# Altium project Jukebox Project.PrjPCB
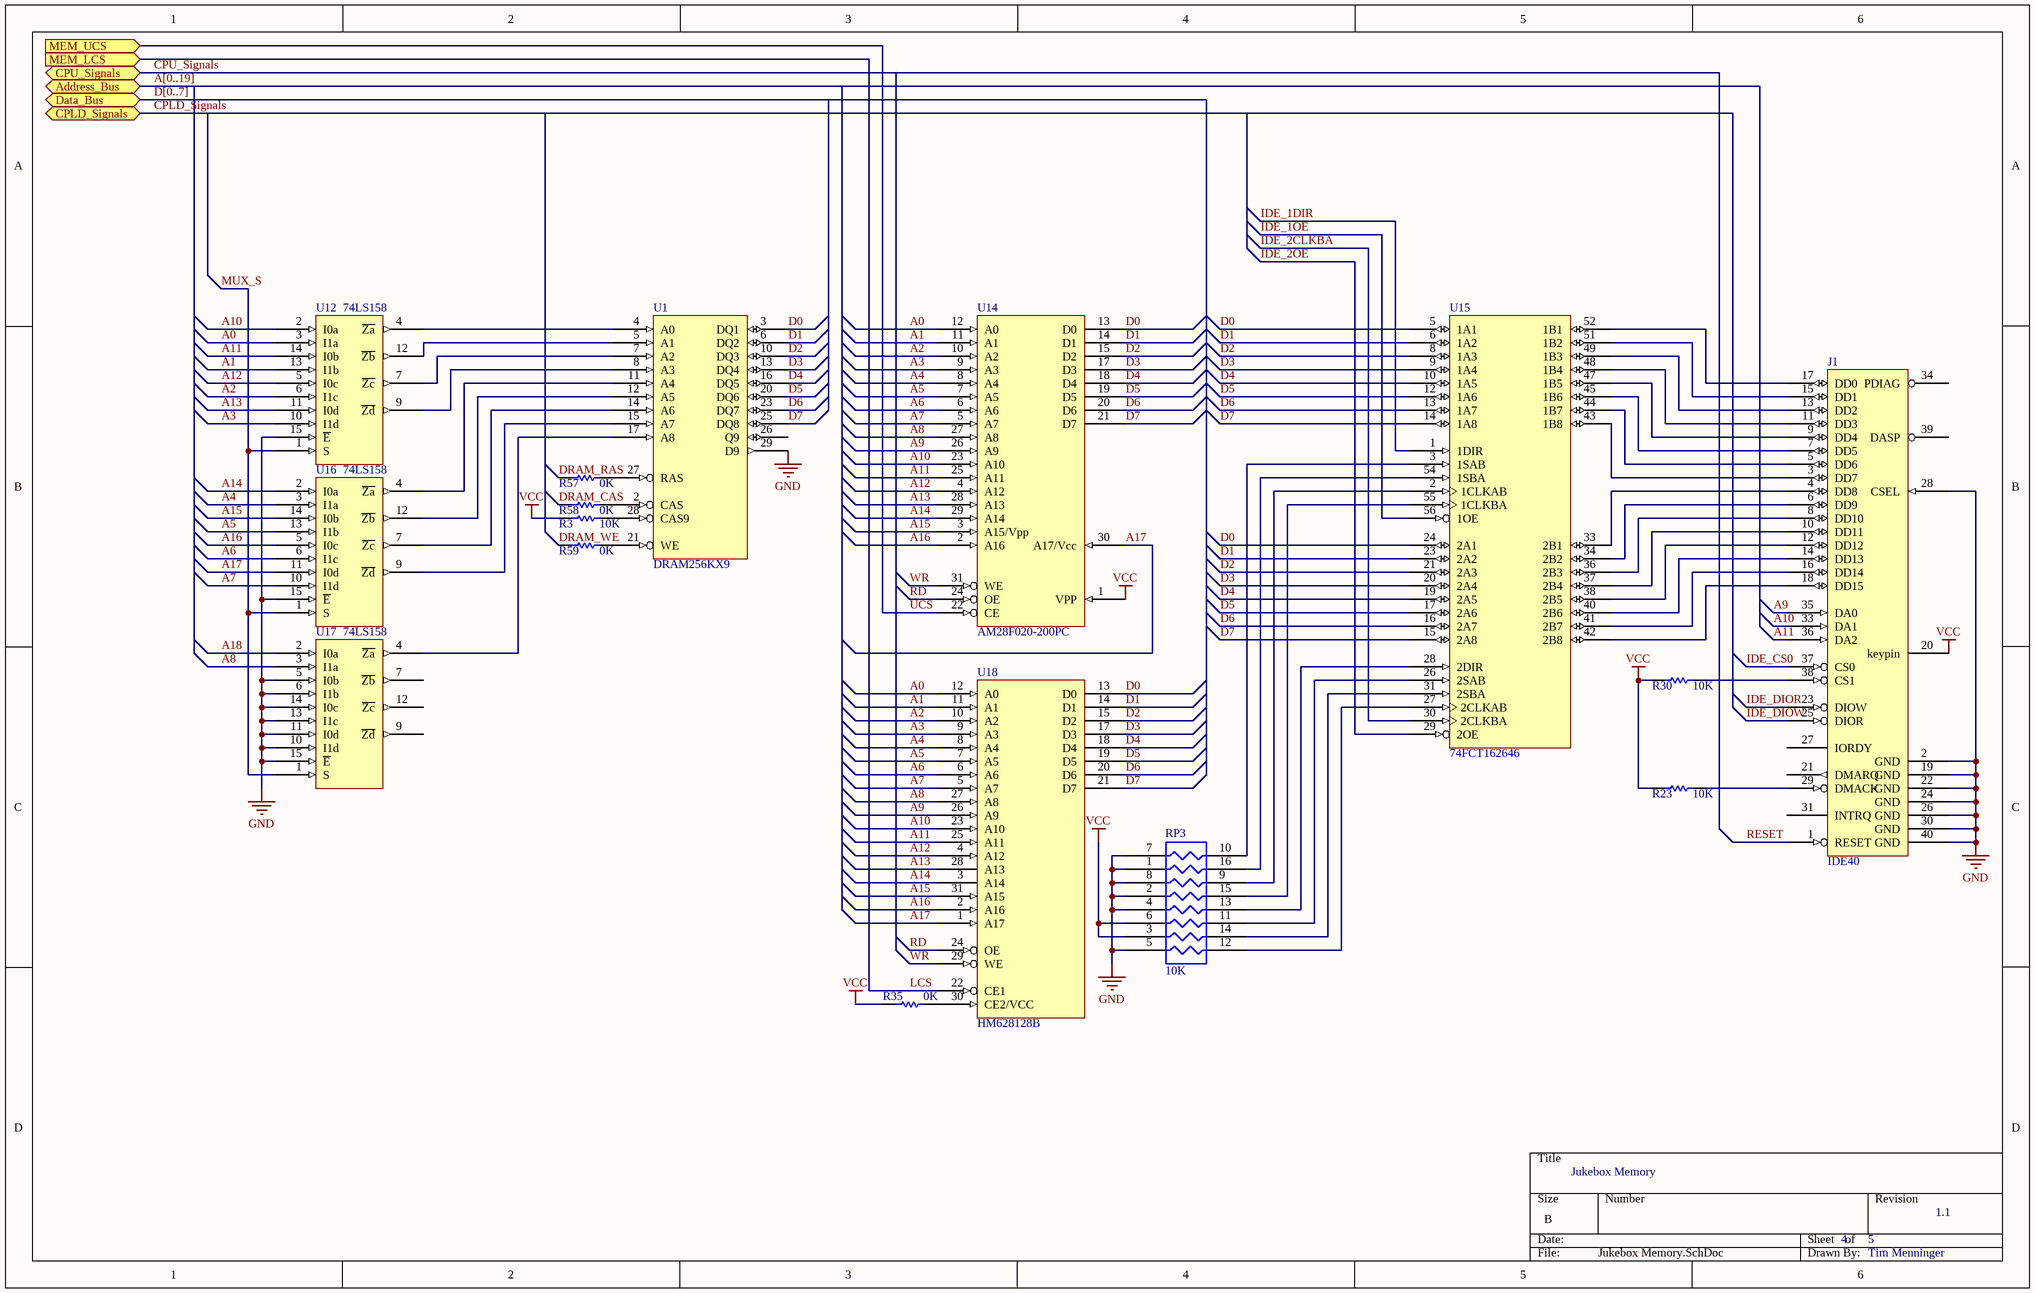
[diagram p0: Jukebox Memory.SchDoc]
4 sheets, 139 parts. Net scope: global (net labels, ports and power ports of the same name join across sheets).
Board file: Jukebox PCB.PCBDOC
Sheets:
  Jukebox Memory.SchDoc
  Jukebox Peripherals.SchDoc
  Jukebox Power.SchDoc
  Jukebox Processing.SchDoc

## Sheet Jukebox Memory.SchDoc: Jukebox Memory
size B; DrawnBy: Tim Menninger; Revision: 1.1; SheetNumber: 4; SheetTotal: 5

### Parts
J1  IDE40  [SIP2X20]
R3  value 10K  [6-0805_L]  (hidden comment: Res1)
R23  value 10K  [6-0805_L]  (hidden comment: Res1)
R30  value 10K  [6-0805_L]  (hidden comment: Res1)
R35  value 0K  [6-0805_L]  (hidden comment: Res1)
R57  value 0K  [6-0805_L]  (hidden comment: Res1)
R58  value 0K  [6-0805_L]  (hidden comment: Res1)
R59  value 0K  [6-0805_L]  (hidden comment: Res1)
RP3  10K  [SSOP16]
U1  DRAM256KX9  [SIMM30]
U12  74LS158  [DIPS16]
U14  AM28F020-200PC  [DIPS32]
U15  74FCT162646  [SSOP56]
U16  74LS158  [DIPS16]
U17  74LS158  [DIPS16]
U18  HM628128B  [DIPS32.300]

### Ports
Address_Bus, CPLD_Signals, CPU_Signals, Data_Bus, MEM_LCS (in), MEM_UCS (in)

### Nets
GND: J1.2(GND) J1.19(GND) J1.22(GND) J1.24(GND) J1.26(GND) J1.28(CSEL) J1.30(GND) J1.40(GND) RP3.1 RP3.2 RP3.4 RP3.5 RP3.7 RP3.8 U1.9(GND) U1.22(GND) U1.29(D9) U12.8(GND) U12.15(~{E}) U14.16(GND) U15.4(GND) U15.11(GND) U15.18(GND) U15.25(GND) U15.32(GND) U15.39(GND) U15.46(GND) U15.53(GND) U16.8(GND) U16.15(~{E}) U17.5(I0b) U17.6(I1b) U17.8(GND) U17.10(I1d) U17.11(I0d) U17.13(I1c) U17.14(I0c) U17.15(~{E}) U18.16(GND)
VCC: J1.20(keypin) R3.2 R23.2 R30.2 R35.2 RP3.3 RP3.6 U1.1(VCC) U1.30(VCC) U12.16(VCC) U14.1(VPP) U14.32(VCC) U15.7(VCC) U15.22(VCC) U15.35(VCC) U15.50(VCC) U16.16(VCC) U17.16(VCC) U18.32(VCC)
A0: U12.3(I1a) U14.12(A0) U18.12(A0)
A1: U12.13(I1b) U14.11(A1) U18.11(A1)
A2: U12.6(I1c) U14.10(A2) U18.10(A2)
A3: U12.10(I1d) U14.9(A3) U18.9(A3)
A4: U14.8(A4) U16.3(I1a) U18.8(A4)
A5: U14.7(A5) U16.13(I1b) U18.7(A5)
A6: U14.6(A6) U16.6(I1c) U18.6(A6)
A7: U14.5(A7) U16.10(I1d) U18.5(A7)
A8: U14.27(A8) U17.3(I1a) U18.27(A8)
A9: J1.35(DA0) U14.26(A9) U18.26(A9)
A10: J1.33(DA1) U12.2(I0a) U14.23(A10) U18.23(A10)
A11: J1.36(DA2) U12.14(I0b) U14.25(A11) U18.25(A11)
A12: U12.5(I0c) U14.4(A12) U18.4(A12)
A13: U12.11(I0d) U14.28(A13) U18.28(A13)
A14: U14.29(A14) U16.2(I0a) U18.3(A14)
A15: U14.3(A15/Vpp) U16.14(I0b) U18.31(A15)
A16: U14.2(A16) U16.5(I0c) U18.2(A16)
A17: U14.30(A17/Vcc) U16.11(I0d) U18.1(A17)
A18: U17.2(I0a)
D0: U1.3(DQ1) U14.13(D0) U15.5(1A1) U15.24(2A1) U18.13(D0)
D1: U1.6(DQ2) U14.14(D1) U15.6(1A2) U15.23(2A2) U18.14(D1)
D2: U1.10(DQ3) U14.15(D2) U15.8(1A3) U15.21(2A3) U18.15(D2)
D3: U1.13(DQ4) U14.17(D3) U15.9(1A4) U15.20(2A4) U18.17(D3)
D4: U1.16(DQ5) U14.18(D4) U15.10(1A5) U15.19(2A5) U18.18(D4)
D5: U1.20(DQ6) U14.19(D5) U15.12(1A6) U15.17(2A6) U18.19(D5)
D6: U1.23(DQ7) U14.20(D6) U15.13(1A7) U15.16(2A7) U18.20(D6)
D7: U1.25(DQ8) U14.21(D7) U15.14(1A8) U15.15(2A8) U18.21(D7)
DRAM_CAS: R58.2
DRAM_RAS: R57.2
DRAM_WE: R59.2
IDE_1DIR: U15.1(1DIR)
IDE_1OE: U15.56(1OE)
IDE_2CLKBA: U15.30(2CLKBA)
IDE_2OE: U15.29(2OE)
IDE_CS0: J1.37(CS0)
IDE_DIOR: J1.23(DIOW)
IDE_DIOW: J1.25(DIOR)
LCS: U18.22(CE1) ; port MEM_LCS
MUX_S: U12.1(S) U16.1(S) U17.1(S)
RD: U14.24(OE) U18.24(OE)
RESET: J1.1(RESET)
UCS: U14.22(CE) ; port MEM_UCS
WR: U14.31(WE) U18.29(WE)
NetJ1_3: J1.3(DD7) U15.43(1B8)
NetJ1_4: J1.4(DD8) U15.33(2B1)
NetJ1_5: J1.5(DD6) U15.44(1B7)
NetJ1_6: J1.6(DD9) U15.34(2B2)
NetJ1_7: J1.7(DD5) U15.45(1B6)
NetJ1_8: J1.8(DD10) U15.36(2B3)
NetJ1_9: J1.9(DD4) U15.47(1B5)
NetJ1_10: J1.10(DD11) U15.37(2B4)
NetJ1_11: J1.11(DD3) U15.48(1B4)
NetJ1_12: J1.12(DD12) U15.38(2B5)
NetJ1_13: J1.13(DD2) U15.49(1B3)
NetJ1_14: J1.14(DD13) U15.40(2B6)
NetJ1_15: J1.15(DD1) U15.51(1B2)
NetJ1_16: J1.16(DD14) U15.41(2B7)
NetJ1_17: J1.17(DD0) U15.52(1B1)
NetJ1_18: J1.18(DD15) U15.42(2B8)
NetJ1_29: J1.29(DMACK) R23.1
NetJ1_38: J1.38(CS1) R30.1
NetR3_1: R3.1 U1.28(CAS9)
NetR35_1: R35.1 U18.30(CE2/VCC)
NetR57_1: R57.1 U1.27(RAS)
NetR58_1: R58.1 U1.2(CAS)
NetR59_1: R59.1 U1.21(WE)
NetRP3_9: RP3.9 U15.2(1CLKAB)
NetRP3_10: RP3.10 U15.3(1SAB)
NetRP3_11: RP3.11 U15.26(2SAB)
NetRP3_12: RP3.12 U15.27(2CLKAB)
NetRP3_13: RP3.13 U15.28(2DIR)
NetRP3_14: RP3.14 U15.31(2SBA)
NetRP3_15: RP3.15 U15.55(1CLKBA)
NetRP3_16: RP3.16 U15.54(1SBA)
NetU1_4: U1.4(A0) U12.4(~{Za})
NetU1_5: U1.5(A1) U12.12(~{Zb})
NetU1_7: U1.7(A2) U12.7(~{Zc})
NetU1_8: U1.8(A3) U12.9(~{Zd})
NetU1_11: U1.11(A4) U16.4(~{Za})
NetU1_12: U1.12(A5) U16.12(~{Zb})
NetU1_14: U1.14(A6) U16.7(~{Zc})
NetU1_15: U1.15(A7) U16.9(~{Zd})
NetU1_17: U1.17(A8) U17.4(~{Za})

Not connected (* = marked no-connect by the designer): J1 21(DMARQ) 27(IORDY) 31(INTRQ) 34(PDIAG) 39(DASP); U1 26(Q9); U17 7(~{Zb}) 9(~{Zd}) 12(~{Zc})

### Buses and harness runs
bus A[0..19] = port Address_Bus
bus CPLD_Signals = port CPLD_Signals
bus CPU_Signals = port CPU_Signals
bus D[0..7] = port Data_Bus

### Library data of the parts
J1 = IDE40: 40-Pin IDE Connector
R3 R23 R30 R35 R57-R59 = Res1: Resistor; Published: 8-Jun-2000; LatestRevisionDate: 17-Jul-2002; LatestRevisionNote: Re-released for DXP Platform.; PackageReference: AXIAL-0.3; Publisher: Altium Limited; PackageDescription: Axial Device, Thru-Hole; 2 Leads; 0.3 in Pin Spacing
RP3 = RPACK8: Resistor Pack - 8 Resistors
U1 = DRAM256KX9: 256K x 9 DRAM SIMM
U14 = UNIROM: Universal EPROM/EEROM Socket
U15 = 74FCT16646: 16-Bit Bus Transceiver/Register
U18 = UNIRAM: Universal RAM Socket

## Sheet Jukebox Peripherals.SchDoc: Jukebox Peripherals
size B; DrawnBy: Tim Menninger; Revision: 1.1; SheetNumber: 3; SheetTotal: 5
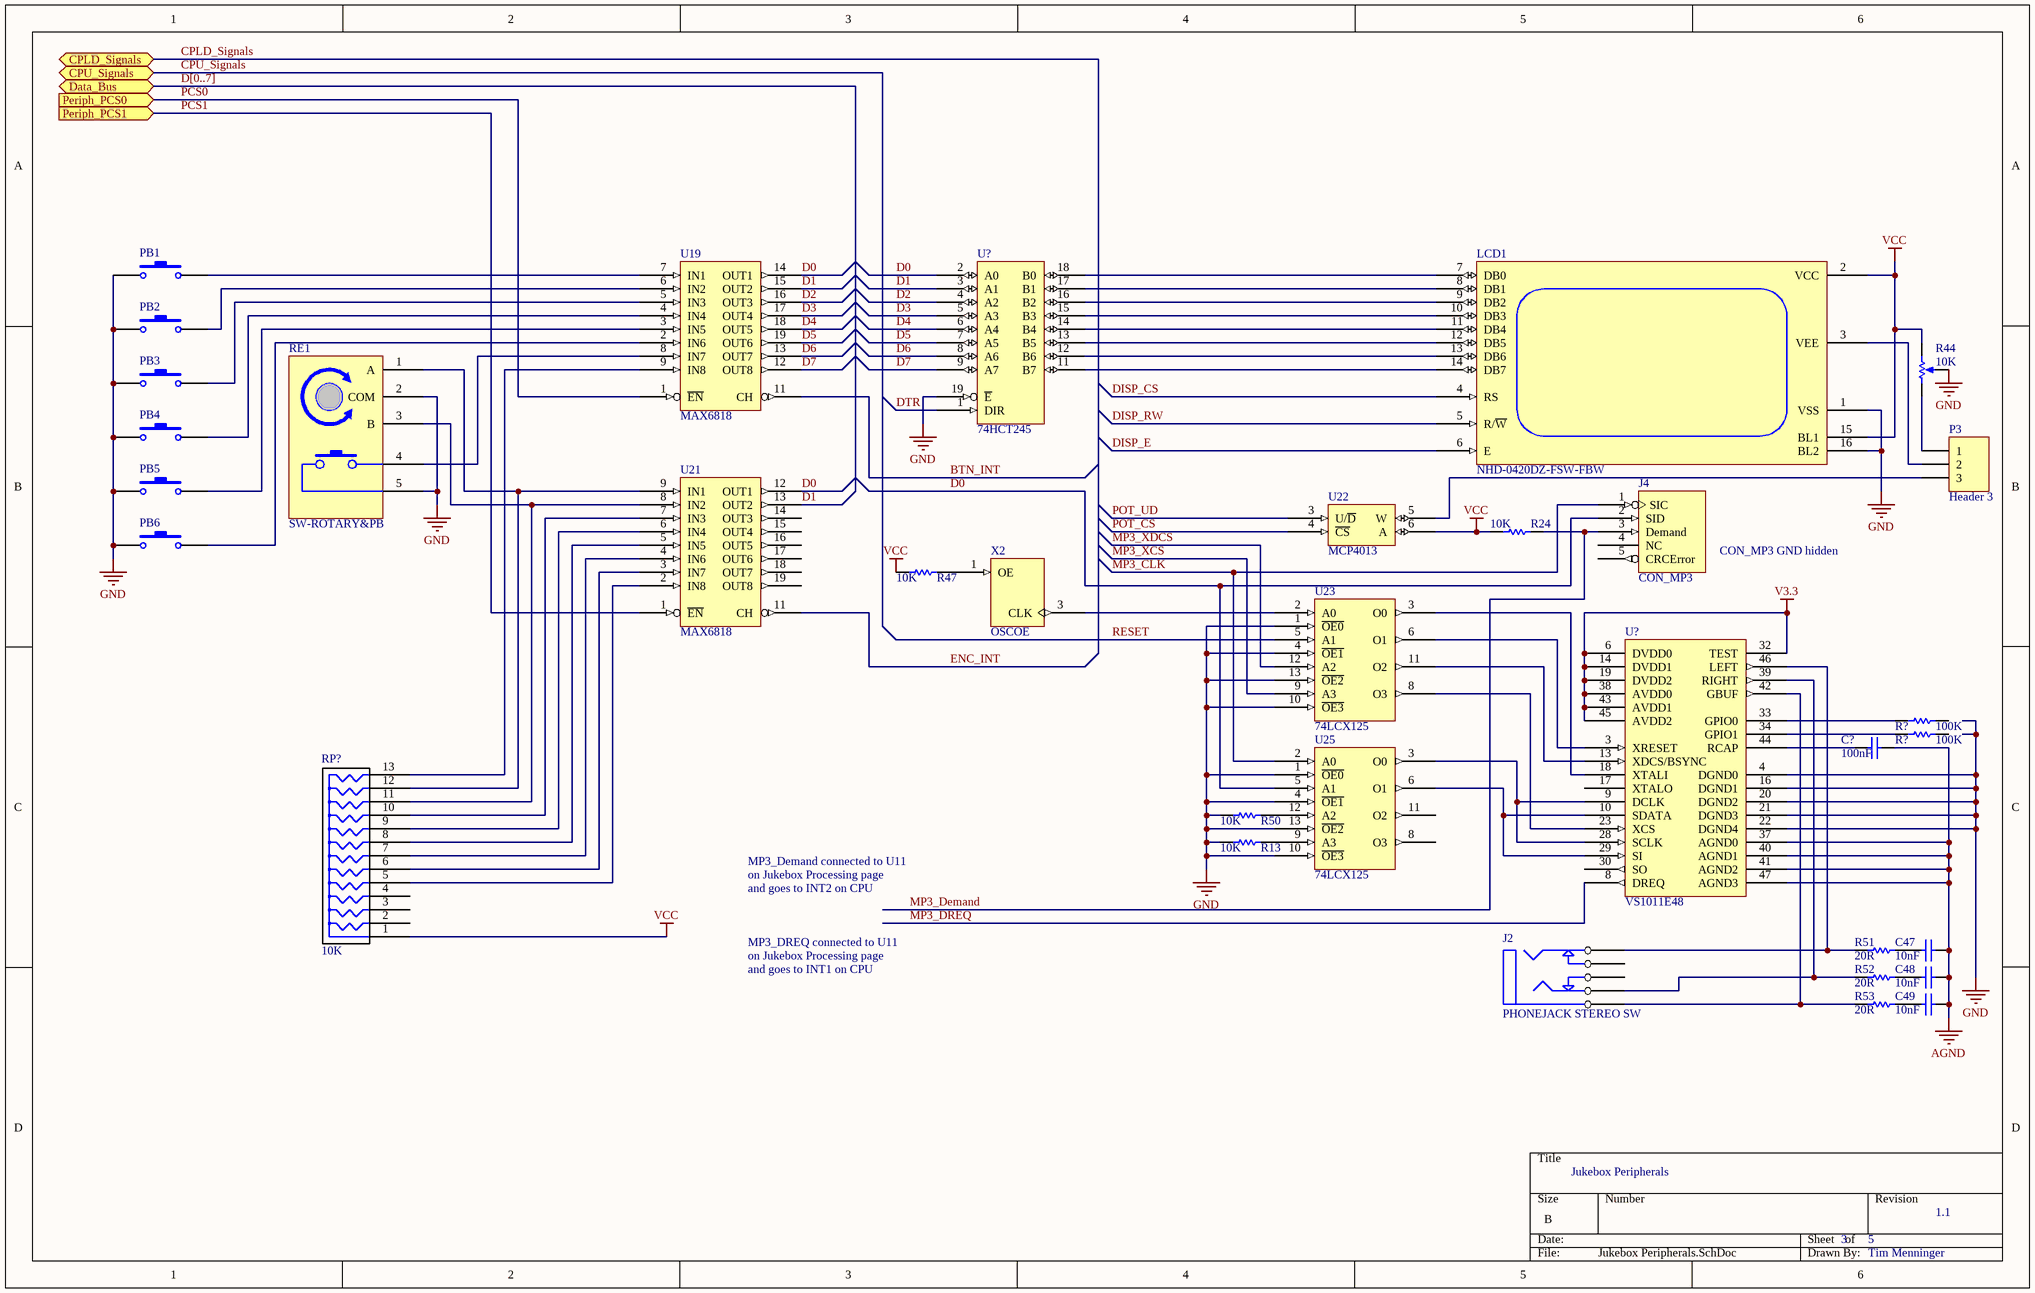
[diagram p1: Jukebox Peripherals.SchDoc]

### Parts
(Parts that share a designator on the sheet are numbered #1, #2 ... from top to bottom, then left to right.)
C47  value 10nF  [C0805]  (hidden comment: Cap)
C48  value 10nF  [C0805]  (hidden comment: Cap)
C49  value 10nF  [C0805]  (hidden comment: Cap)
C?  value 100nF  [C0805]  (hidden comment: Cap)
J2  PHONEJACK STEREO SW  [SJ1-352]
J4  CON_MP3  [MDIN6]
LCD1  NHD-0420DZ-FSW-FBW  [20x4Disp]
P3  Header 3  [HDR1X3]
PB1  SW-PB  [PB_EG4791]  (value not drawn)
PB2  SW-PB  [PB_EG4791]  (value not drawn)
PB3  SW-PB  [PB_EG4791]  (value not drawn)
PB4  SW-PB  [PB_EG4791]  (value not drawn)
PB5  SW-PB  [PB_EG4791]  (value not drawn)
PB6  SW-PB  [PB_EG4791]  (value not drawn)
R13  value 10K  [6-0805_L]  (hidden comment: Res1)
R24  value 10K  [6-0805_L]  (hidden comment: Res1)
R44  value 10K  [VR4]  (hidden comment: RPot)
R47  value 10K  [6-0805_L]  (hidden comment: Res1)
R50  value 10K  [6-0805_L]  (hidden comment: Res1)
R51  value 20R  [6-0805_L]  (hidden comment: Res1)
R52  value 20R  [6-0805_L]  (hidden comment: Res1)
R53  value 20R  [6-0805_L]  (hidden comment: Res1)
R?#1  value 100K  [6-0805_L]  (hidden comment: Res1)
R?#2  value 100K  [6-0805_L]  (hidden comment: Res1)
RE1  SW-ROTARY&PB  [ROTENCPB]
RP?#1  10K
U19  MAX6818  [SSOP20]
U21  MAX6818  [SSOP20]
U22  MCP4013  [SOT-23-6]
U23  74LCX125  [SOIC 14]
U25  74LCX125  [SOIC 14]
U?#1  74HCT245  [DIP20]
U?#2  VS1011E48  [LQFP48]
X2  OSCOE  [DIP14-4]

### Ports
CPLD_Signals, CPU_Signals, Data_Bus, Periph_PCS0 (in), Periph_PCS1 (in)

### Nets
AGND: C47.2 C48.2 C49.2 C?.2 U23.7(AGND) U25.7(AGND) U?#2.37(AGND0) U?#2.40(AGND1) U?#2.41(AGND2) U?#2.47(AGND3)
GND: LCD1.1(VSS) LCD1.16(BL2) PB1.1 PB2.1 PB3.1 PB4.1 PB5.1 PB6.1 R13.1 R44.3(TAP) R50.1 RE1.2(COM) RE1.5 U19.10(GND) U21.10(GND) U22.2(GND) U23.1(~{O}~{E}~{0}) U23.4(~{O}~{E}~{1}) U23.10(~{OE3}) U23.13(~{OE2}) U25.1(~{O}~{E}~{0}) U25.4(~{O}~{E}~{1}) U25.10(~{OE3}) U25.13(~{OE2}) U?#1.10(GND) U?#1.19(~{E}) U?#2.4(DGND0) U?#2.16(DGND1) U?#2.20(DGND2) U?#2.21(DGND3) U?#2.22(DGND4) X2.2(GND)
V3.3: U23.14(VCC) U25.14(VCC) U?#2.6(DVDD0) U?#2.14(DVDD1) U?#2.19(DVDD2) U?#2.32(TEST) U?#2.38(AVDD0) U?#2.43(AVDD1) U?#2.45(AVDD2)
VCC: LCD1.2(VCC) LCD1.15(BL1) R24.1 R44.2(BOT) R47.1 RP?#1.1 U19.20(VCC) U21.20(VCC) U22.1(VCC) U22.6(A) U?#1.20(VCC) X2.4(VCC)
BTN_INT: U19.11(CH)
D0: J4.2(SID) U19.14(OUT1) U21.12(OUT1) U25.5(A1) U?#1.2(A0)
D1: U19.15(OUT2) U21.13(OUT2) U?#1.3(A1)
D2: U19.16(OUT3) U?#1.4(A2)
D3: U19.17(OUT4) U?#1.5(A3)
D4: U19.18(OUT5) U?#1.6(A4)
D5: U19.19(OUT6) U?#1.7(A5)
D6: U19.13(OUT7) U?#1.8(A6)
D7: U19.12(OUT8) U?#1.9(A7)
DISP_CS: LCD1.4(RS)
DISP_E: LCD1.6(E)
DISP_RW: LCD1.5(R/~{W})
DTR: U?#1.1(DIR)
ENC_INT: U21.11(CH)
MP3_CLK: J4.1(SIC) U25.2(A0)
MP3_Demand: J4.3(Demand) R24.2
MP3_DREQ: U?#2.8(DREQ)
MP3_XCS: U23.9(A3)
MP3_XDCS: U23.12(A2)
PCS0: U19.1(~{EN}) ; port Periph_PCS0
PCS1: U21.1(~{EN}) ; port Periph_PCS1
POT_CS: U22.4(~{CS})
POT_UD: U22.3(U/~{D})
RESET: U23.5(A1)
NetC47_1: C47.1 R51.1
NetC48_1: C48.1 R52.1
NetC49_1: C49.1 R53.1
NetC?_1: C?.1 U?#2.44(RCAP)
NetJ2_A: J2.A(RING) R51.2 U?#2.46(LEFT)
NetJ2_D: J2.D(TIP) R52.2 U?#2.39(RIGHT)
NetJ2_E: J2.E(SLEEVE) R53.2 U?#2.42(GBUF)
NetLCD1_3: LCD1.3(VEE) P3.2
NetLCD1_7: LCD1.7(DB0) U?#1.18(B0)
NetLCD1_8: LCD1.8(DB1) U?#1.17(B1)
NetLCD1_9: LCD1.9(DB2) U?#1.16(B2)
NetLCD1_10: LCD1.10(DB3) U?#1.15(B3)
NetLCD1_11: LCD1.11(DB4) U?#1.14(B4)
NetLCD1_12: LCD1.12(DB5) U?#1.13(B5)
NetLCD1_13: LCD1.13(DB6) U?#1.12(B6)
NetLCD1_14: LCD1.14(DB7) U?#1.11(B7)
NetP3_1: P3.1 R44.1(TOP)
NetP3_3: P3.3 U22.5(W)
NetPB1_2: PB1.2 U19.7(IN1)
NetPB2_2: PB2.2 U19.6(IN2)
NetPB3_2: PB3.2 U19.5(IN3)
NetPB4_2: PB4.2 U19.4(IN4)
NetPB5_2: PB5.2 U19.3(IN5)
NetPB6_2: PB6.2 U19.2(IN6)
NetR13_2: R13.2 U25.9(A3)
NetR47_2: R47.2 X2.1(OE)
NetR50_2: R50.2 U25.12(A2)
NetR?#1_2: R?#1.2 U?#2.33(GPIO0)
NetR?#2_2: R?#2.2 U?#2.34(GPIO1)
NetRE1_1: RE1.1(A) RP?#1.12 U21.9(IN1)
NetRE1_3: RE1.3(B) RP?#1.11 U21.8(IN2)
NetRE1_4: RE1.4 U19.8(IN7)
NetRP?#1_5: RP?#1.5 U21.2(IN8)
NetRP?#1_6: RP?#1.6 U21.3(IN7)
NetRP?#1_7: RP?#1.7 U21.4(IN6)
NetRP?#1_8: RP?#1.8 U21.5(IN5)
NetRP?#1_9: RP?#1.9 U21.6(IN4)
NetRP?#1_10: RP?#1.10 U21.7(IN3)
NetRP?#1_13: RP?#1.13 U19.9(IN8)
NetU23_2: U23.2(A0) X2.3(CLK)
NetU23_3: U23.3(O0) U?#2.18(XTALI)
NetU23_6: U23.6(O1) U?#2.3(XRESET)
NetU23_8: U23.8(O3) U?#2.23(XCS)
NetU23_11: U23.11(O2) U?#2.13(XDCS/BSYNC)
NetU25_3: U25.3(O0) U?#2.9(DCLK) U?#2.28(SCLK)
NetU25_6: U25.6(O1) U?#2.10(SDATA) U?#2.29(SI)

Not connected (* = marked no-connect by the designer): J2 B(RINGSW) C(TIPSW); J4 4(NC) 5(CRCError) 6(GND); R?#1 1; R?#2 1; RP?#1 2 3 4; U21 14(OUT3) 15(OUT4) 16(OUT5) 17(OUT6) 18(OUT7) 19(OUT8); U25 8(O3) 11(O2); U?#2 17(XTALO) 30(SO)

### Buses and harness runs
bus CPLD_Signals = port CPLD_Signals
bus CPU_Signals = port CPU_Signals
bus D[0..7] = port Data_Bus

### Notes on the sheet
- CON_MP3 GND hidden
- MP3_Demand connected to U11
- on Jukebox Processing page
- and goes to INT2 on CPU
- MP3_DREQ connected to U11
- and goes to INT1 on CPU

### Library data of the parts
C47-C49 C? = Cap: Capacitor; Published: 8-Jun-2000; LatestRevisionDate: 17-Jul-2002; LatestRevisionNote: Re-released for DXP Platform.; PackageReference: RAD-0.3; Publisher: Altium Limited; PackageDescription: Radial Cap, Thru-Hole; 2 Leads; 0.3 in Pin Spacing
J2 = PHONEJACK STEREO SW: 3.5mm Stereo Jack with Switches
J4 = CON_MP3: MP3 Connector
LCD1 = LCDBL16PIN: Single E LCD with Backlight
P3 = Header 3: Header, 3-Pin; LatestRevisionDate: 17-Jul-2002; LatestRevisionNote: Re-released for DXP Platform.; Publisher: Altium Limited
PB1-PB6 = SW-PB: Switch; Published: 24-Mar-1999; LatestRevisionDate: 17-Jul-2002; LatestRevisionNote: Re-released for DXP Platform.; PackageReference: SPST-2; Publisher: Altium Limited; PackageDescription: Switch; 2 Leads
R13 R24 R47 R50-R53 R?#1 R?#2 = Res1: Resistor; Published: 8-Jun-2000; LatestRevisionDate: 17-Jul-2002; LatestRevisionNote: Re-released for DXP Platform.; PackageReference: AXIAL-0.3; Publisher: Altium Limited; PackageDescription: Axial Device, Thru-Hole; 2 Leads; 0.3 in Pin Spacing
R44 = RPot: Potentiometer; Sim Note: Enter the Resistance value and the set point into parameter fields.; Set Position: 0.5; Published: 8-Jun-2000; LatestRevisionDate: 17-Jul-2002; LatestRevisionNote: Re-released for DXP Platform.; PackageReference: VR5; Publisher: Altium Limited; PackageDescription: Variable Resistor, Thru-Hole; 3 Leads
RE1 = SW-ROTARY&PB: Rotary Encoder with Built-In Push Button
RP?#1 = RPACK12
U19 U21 = MAX6818: Octal Switch Debouncer
U?#1 = 74HCT245: Octal Bus Transceiver
X2 = OSCOE: Oscillator with Active High Output Enable

## Sheet Jukebox Power.SchDoc: Jukebox Power
size B; DrawnBy: Tim Menninger; Revision: 1.1; SheetNumber: 5; SheetTotal: 5
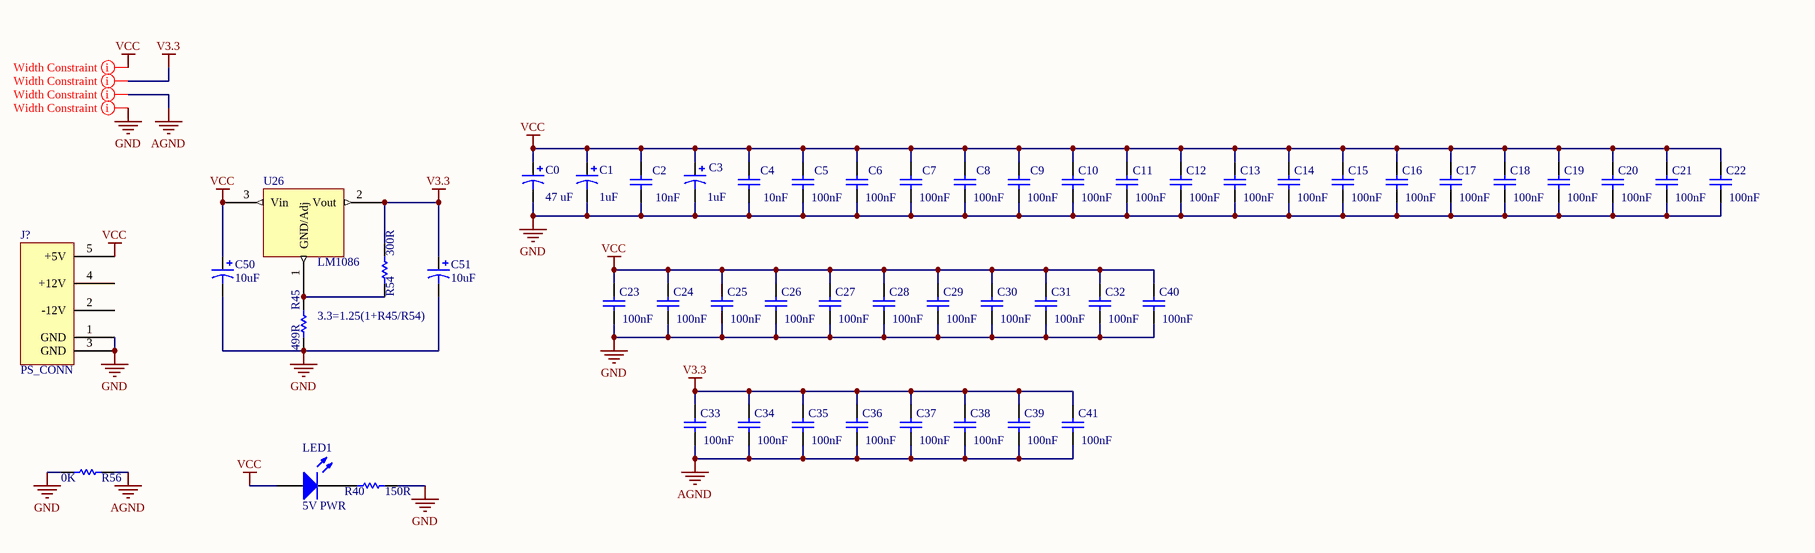
[diagram p2: Jukebox Power.SchDoc]

### Parts
C0  value 47 uF  [RB.1/.2]  (hidden comment: Cap Pol3)
C1  value 1uF  [C0805]  (hidden comment: Cap Pol3)
C2  value 10nF  [C0805]  (hidden comment: Cap)
C3  value 1uF  [C0805]  (hidden comment: Cap Pol3)
C4  value 10nF  [C0805]  (hidden comment: Cap)
C5  value 100nF  [C0805]  (hidden comment: Cap)
C6  value 100nF  [C0805]  (hidden comment: Cap)
C7  value 100nF  [C0805]  (hidden comment: Cap)
C8  value 100nF  [C0805]  (hidden comment: Cap)
C9  value 100nF  [C0805]  (hidden comment: Cap)
C10  value 100nF  [C0805]  (hidden comment: Cap)
C11  value 100nF  [C0805]  (hidden comment: Cap)
C12  value 100nF  [C0805]  (hidden comment: Cap)
C13  value 100nF  [C0805]  (hidden comment: Cap)
C14  value 100nF  [C0805]  (hidden comment: Cap)
C15  value 100nF  [C0805]  (hidden comment: Cap)
C16  value 100nF  [C0805]  (hidden comment: Cap)
C17  value 100nF  [C0805]  (hidden comment: Cap)
C18  value 100nF  [C0805]  (hidden comment: Cap)
C19  value 100nF  [C0805]  (hidden comment: Cap)
C20  value 100nF  [C0805]  (hidden comment: Cap)
C21  value 100nF  [C0805]  (hidden comment: Cap)
C22  value 100nF  [C0805]  (hidden comment: Cap)
C23  value 100nF  [C0805]  (hidden comment: Cap)
C24  value 100nF  [C0805]  (hidden comment: Cap)
C25  value 100nF  [C0805]  (hidden comment: Cap)
C26  value 100nF  [C0805]  (hidden comment: Cap)
C27  value 100nF  [C0805]  (hidden comment: Cap)
C28  value 100nF  [C0805]  (hidden comment: Cap)
C29  value 100nF  [C0805]  (hidden comment: Cap)
C30  value 100nF  [C0805]  (hidden comment: Cap)
C31  value 100nF  [C0805]  (hidden comment: Cap)
C32  value 100nF  [C0805]  (hidden comment: Cap)
C33  value 100nF  [C0805]  (hidden comment: Cap)
C34  value 100nF  [C0805]  (hidden comment: Cap)
C35  value 100nF  [C0805]  (hidden comment: Cap)
C36  value 100nF  [C0805]  (hidden comment: Cap)
C37  value 100nF  [C0805]  (hidden comment: Cap)
C38  value 100nF  [C0805]  (hidden comment: Cap)
C39  value 100nF  [C0805]  (hidden comment: Cap)
C40  value 100nF  [C0805]  (hidden comment: Cap)
C41  value 100nF  [C0805]  (hidden comment: Cap)
C50  value 10uF  [C0805]  (hidden comment: Cap Pol3)
C51  value 10uF  [C0805]  (hidden comment: Cap Pol3)
J?  PS_CONN  [DIN5]
LED1  5V PWR  [3.2X1.6X1.1]
R40  value 150R  [6-0805_L]  (hidden comment: Res1)
R45  value 499R  [6-0805_L]  (hidden comment: Res1)
R54  value 300R  [6-0805_L]  (hidden comment: Res1)
R56  value 0K  [6-0805_L]  (hidden comment: Res1)
U26  LM1086  [TO-220]

### Nets
AGND: C33.1 C34.1 C35.1 C36.1 C37.1 C38.1 C39.1 C41.1 R56.1
GND: C0.2 C1.2 C2.1 C3.2 C4.1 C5.1 C6.1 C7.1 C8.1 C9.1 C10.1 C11.1 C12.1 C13.1 C14.1 C15.1 C16.1 C17.1 C18.1 C19.1 C20.1 C21.1 C22.1 C23.1 C24.1 C25.1 C26.1 C27.1 C28.1 C29.1 C30.1 C31.1 C32.1 C40.1 C50.2 C51.2 J?.1(GND) J?.3(GND) R40.1 R45.2 R56.2
V3.3: C33.2 C34.2 C35.2 C36.2 C37.2 C38.2 C39.2 C41.2 C51.1 R54.2 U26.2(Vout)
VCC: C0.1 C1.1 C2.2 C3.1 C4.2 C5.2 C6.2 C7.2 C8.2 C9.2 C10.2 C11.2 C12.2 C13.2 C14.2 C15.2 C16.2 C17.2 C18.2 C19.2 C20.2 C21.2 C22.2 C23.2 C24.2 C25.2 C26.2 C27.2 C28.2 C29.2 C30.2 C31.2 C32.2 C40.2 C50.1 J?.5(+5V) LED1.1(A) U26.3(Vin)
NetLED1_2: LED1.2(K) R40.2
NetR45_1: R45.1 R54.1 U26.1(GND/Adj)

Not connected (* = marked no-connect by the designer): J? 2(-12V) 4(+12V)

### Layout directives
rule Width Constraint [Pref Width = 30mil    Min Width = 8mil    Max Width = 30mil]: AGND, GND, V3.3, VCC

### Notes on the sheet
- (near R45) 3.3=1.25(1+R45/R54)
- Labels drawn without touching a wire or pin: GND, VCC

### Library data of the parts
C0 C1 C3 C50 C51 = Cap Pol3: Polarized Capacitor (Surface Mount); Published: 8-Jun-2000; LatestRevisionDate: 29-May-2009; LatestRevisionNote: IPC-7351 Footprint Added.; PackageReference: C0805; Publisher: Altium Limited; PackageDescription: Chip Capacitor
C2 C4-C41 = Cap: Capacitor; Published: 8-Jun-2000; LatestRevisionDate: 17-Jul-2002; LatestRevisionNote: Re-released for DXP Platform.; PackageReference: RAD-0.3; Publisher: Altium Limited; PackageDescription: Radial Cap, Thru-Hole; 2 Leads; 0.3 in Pin Spacing
J? = PS_CONN: Elpac Compatible Power Supply Connector
LED1 = LED2: Typical RED, GREEN, YELLOW, AMBER GaAs LED; Published: 8-Jun-2000; LatestRevisionDate: 17-Jul-2002; LatestRevisionNote: Re-released for DXP Platform.; PackageVersion: Feb-2002; PackageReference: 3.2X1.6X1.1; Publisher: Altium Limited; PackageDescription: SM LED; 2 Flat Leads
R40 R45 R54 R56 = Res1: Resistor; Published: 8-Jun-2000; LatestRevisionDate: 17-Jul-2002; LatestRevisionNote: Re-released for DXP Platform.; PackageReference: AXIAL-0.3; Publisher: Altium Limited; PackageDescription: Axial Device, Thru-Hole; 2 Leads; 0.3 in Pin Spacing
U26 = LM1086: 1.5A Low Dropout Positive Regulator

## Sheet Jukebox Processing.SchDoc: Jukebox CPU and CPLD
size B; DrawnBy: Tim Menninger; Revision: 2.0; SheetNumber: 2; SheetTotal: 5
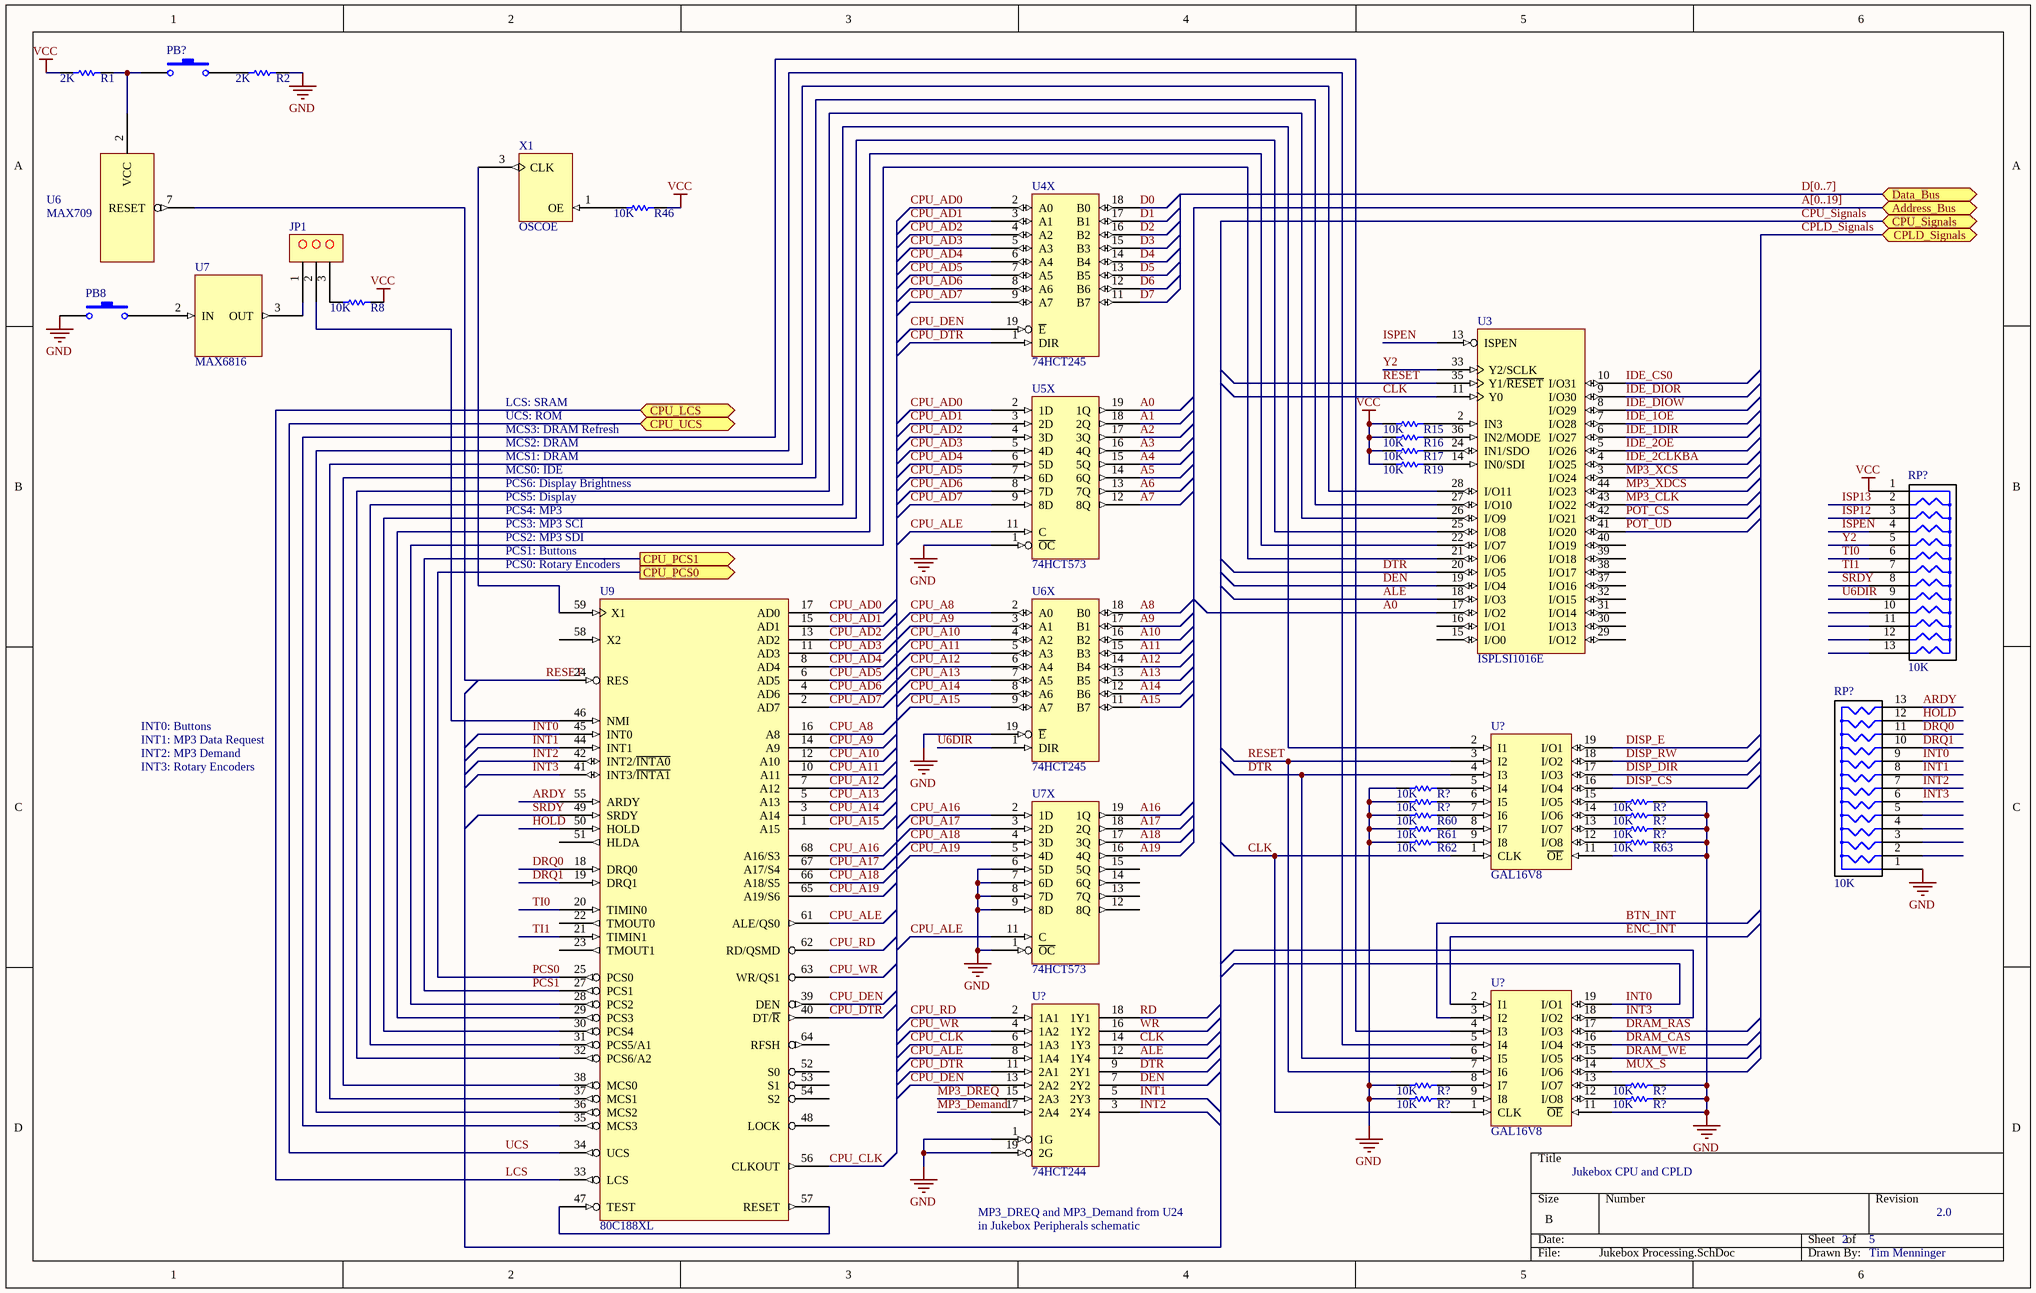
[diagram p3: Jukebox Processing.SchDoc]

### Parts
(Parts that share a designator on the sheet are numbered #1, #2 ... from top to bottom, then left to right.)
JP1  3P_JP  [HDR1X3]  (value not drawn)
PB8  SW-PB  [KSR_PB_NC]  (value not drawn)
PB?  SW-PB  [KSR_PB_NC]  (value not drawn)
R1  value 2K  [6-0805_L]  (hidden comment: Res1)
R2  value 2K  [6-0805_L]  (hidden comment: Res1)
R8  value 10K  [6-0805_L]  (hidden comment: Res1)
R15  value 10K  [6-0805_L]  (hidden comment: Res1)
R16  value 10K  [6-0805_L]  (hidden comment: Res1)
R17  value 10K  [6-0805_L]  (hidden comment: Res1)
R19  value 10K  [6-0805_L]  (hidden comment: Res1)
R46  value 10K  [6-0805_L]  (hidden comment: Res1)
R60  value 10K  [6-0805_L]  (hidden comment: Res1)
R61  value 10K  [6-0805_L]  (hidden comment: Res1)
R62  value 10K  [6-0805_L]  (hidden comment: Res1)
R63  value 10K  [6-0805_L]  (hidden comment: Res1)
R?#3  value 10K  [6-0805_L]  (hidden comment: Res1)
R?#4  value 10K  [6-0805_L]  (hidden comment: Res1)
R?#5  value 10K  [6-0805_L]  (hidden comment: Res1)
R?#6  value 10K  [6-0805_L]  (hidden comment: Res1)
R?#7  value 10K  [6-0805_L]  (hidden comment: Res1)
R?#8  value 10K  [6-0805_L]  (hidden comment: Res1)
R?#9  value 10K  [6-0805_L]  (hidden comment: Res1)
R?#10  value 10K  [6-0805_L]  (hidden comment: Res1)
R?#11  value 10K  [6-0805_L]  (hidden comment: Res1)
RP?#2  10K
RP?#3  10K
U3  ISPLSI1016E  [PLCCS44]
U4X  74HCT245  [DIP20]
U5X  74HCT573  [DIP20]
U6  MAX709  [UMAX8]
U6X  74HCT245  [DIP20]
U7  MAX6816  [SOT-143]
U7X  74HCT573  [DIP20]
U9  80C188XL  [PLCCS68I]
U?#3  GAL16V8
U?#4  74HCT244  [DIP20]
U?#5  GAL16V8
X1  OSCOE  [DIPS8-4]

### Ports
Address_Bus, CPLD_Signals, CPU_LCS, CPU_PCS0 (out), CPU_PCS1 (out), CPU_Signals, CPU_UCS, Data_Bus

### Nets
GND: PB8.1 R2.2 R60.1 R61.1 R62.1 R63.2 R?#3.1 R?#4.1 R?#5.2 R?#6.2 R?#7.2 R?#8.1 R?#9.2 R?#10.1 R?#11.2 RP?#3.1 U3.1(GND) U3.23(GND) U4X.10(GND) U5X.1(~{OC}) U5X.10(GND) U6.3(GND) U6X.10(GND) U6X.19(~{E}) U7.1(GND) U7X.1(~{OC}) U7X.6(5D) U7X.7(6D) U7X.8(7D) U7X.9(8D) U7X.10(GND) U9.26(GND) U9.60(GND) U?#3.10(GND) U?#3.11(~{OE}) U?#4.1(1G) U?#4.10(GND) U?#4.19(2G) U?#5.10(GND) U?#5.11(~{OE}) X1.2(GND)
VCC: R1.1 R8.2 R15.1 R16.1 R17.1 R19.1 R46.2 RP?#2.1 U3.12(VCC) U3.34(VCC) U4X.20(VCC) U5X.20(VCC) U6X.20(VCC) U7.4(VCC) U7X.20(VCC) U9.9(VCC) U9.43(VCC) U?#3.20(VCC) U?#4.20(VCC) U?#5.20(VCC) X1.4(VCC)
A0: U3.17(I/O2) U5X.19(1Q)
A1: U5X.18(2Q)
A2: U5X.17(3Q)
A3: U5X.16(4Q)
A4: U5X.15(5Q)
A5: U5X.14(6Q)
A6: U5X.13(7Q)
A7: U5X.12(8Q)
A8: U6X.18(B0)
A9: U6X.17(B1)
A10: U6X.16(B2)
A11: U6X.15(B3)
A12: U6X.14(B4)
A13: U6X.13(B5)
A14: U6X.12(B6)
A15: U6X.11(B7)
A16: U7X.19(1Q)
A17: U7X.18(2Q)
A18: U7X.17(3Q)
A19: U7X.16(4Q)
ALE: U3.18(I/O3) U?#4.12(1Y4)
ARDY: RP?#3.13 U9.55(ARDY)
BTN_INT: U?#5.3(I2)
CLK: U3.11(Y0) U?#3.1(CLK) U?#4.14(1Y3) U?#5.1(CLK)
CPU_A8: U6X.2(A0) U9.16(A8)
CPU_A9: U6X.3(A1) U9.14(A9)
CPU_A10: U6X.4(A2) U9.12(A10)
CPU_A11: U6X.5(A3) U9.10(A11)
CPU_A12: U6X.6(A4) U9.7(A12)
CPU_A13: U6X.7(A5) U9.5(A13)
CPU_A14: U6X.8(A6) U9.3(A14)
CPU_A15: U6X.9(A7) U9.1(A15)
CPU_A16: U7X.2(1D) U9.68(A16/S3)
CPU_A17: U7X.3(2D) U9.67(A17/S4)
CPU_A18: U7X.4(3D) U9.66(A18/S5)
CPU_A19: U7X.5(4D) U9.65(A19/S6)
CPU_AD0: U4X.2(A0) U5X.2(1D) U9.17(AD0)
CPU_AD1: U4X.3(A1) U5X.3(2D) U9.15(AD1)
CPU_AD2: U4X.4(A2) U5X.4(3D) U9.13(AD2)
CPU_AD3: U4X.5(A3) U5X.5(4D) U9.11(AD3)
CPU_AD4: U4X.6(A4) U5X.6(5D) U9.8(AD4)
CPU_AD5: U4X.7(A5) U5X.7(6D) U9.6(AD5)
CPU_AD6: U4X.8(A6) U5X.8(7D) U9.4(AD6)
CPU_AD7: U4X.9(A7) U5X.9(8D) U9.2(AD7)
CPU_ALE: U5X.11(C) U7X.11(C) U9.61(ALE/QS0) U?#4.8(1A4)
CPU_CLK: U9.56(CLKOUT) U?#4.6(1A3)
CPU_DEN: U4X.19(~{E}) U9.39(DEN) U?#4.13(2A2)
CPU_DTR: U4X.1(DIR) U9.40(DT/~{R}) U?#4.11(2A1)
CPU_RD: U9.62(RD/QSMD) U?#4.2(1A1)
CPU_WR: U9.63(WR/QS1) U?#4.4(1A2)
D0: U4X.18(B0)
D1: U4X.17(B1)
D2: U4X.16(B2)
D3: U4X.15(B3)
D4: U4X.14(B4)
D5: U4X.13(B5)
D6: U4X.12(B6)
D7: U4X.11(B7)
DEN: U3.19(I/O4) U?#4.7(2Y2)
DISP_CS: U?#3.16(I/O4)
DISP_DIR: U?#3.17(I/O3)
DISP_E: U?#3.19(I/O1)
DISP_RW: U?#3.18(I/O2)
DRAM_CAS: U?#5.16(I/O4)
DRAM_RAS: U?#5.17(I/O3)
DRAM_WE: U?#5.15(I/O5)
DRQ0: RP?#3.11 U9.18(DRQ0)
DRQ1: RP?#3.10 U9.19(DRQ1)
DTR: U3.20(I/O5) U?#3.4(I3) U?#4.9(2Y1) U?#5.6(I5)
ENC_INT: U?#5.2(I1)
HOLD: RP?#3.12 U9.50(HOLD)
IDE_1DIR: U3.6(I/O27)
IDE_1OE: U3.7(I/O28)
IDE_2CLKBA: U3.4(I/O25)
IDE_2OE: U3.5(I/O26)
IDE_CS0: U3.10(I/O31)
IDE_DIOR: U3.9(I/O30)
IDE_DIOW: U3.8(I/O29)
INT0: RP?#3.9 U9.45(INT0) U?#5.19(I/O1)
INT1: RP?#3.8 U9.44(INT1) U?#4.5(2Y3)
INT2: RP?#3.7 U9.42(INT2/~{INTA0}) U?#4.3(2Y4)
INT3: RP?#3.6 U9.41(INT3/~{INTA1}) U?#5.18(I/O2)
ISP12: RP?#2.3
ISP13: RP?#2.2
ISPEN: RP?#2.4 U3.13(ISPEN)
LCS: U9.33(LCS) ; port CPU_LCS
MP3_CLK: U3.43(I/O22)
MP3_Demand: U?#4.17(2A4)
MP3_DREQ: U?#4.15(2A3)
MP3_XCS: U3.3(I/O24)
MP3_XDCS: U3.44(I/O23)
MUX_S: U?#5.14(I/O6)
PCS0: U9.25(PCS0) ; port CPU_PCS0
PCS1: U9.27(PCS1) ; port CPU_PCS1
POT_CS: U3.42(I/O21)
POT_UD: U3.41(I/O20)
RD: U?#4.18(1Y1)
RESET: U3.35(Y1/~{RESET}) U6.7(RESET) U9.24(RES) U?#3.3(I2) U?#5.7(I6)
SRDY: RP?#2.8 U9.49(SRDY)
TI0: RP?#2.6 U9.20(TIMIN0)
TI1: RP?#2.7 U9.21(TIMIN1)
U6DIR: RP?#2.9 U6X.1(DIR)
UCS: U9.34(UCS) ; port CPU_UCS
WR: U?#4.16(1Y2)
Y2: RP?#2.5 U3.33(Y2/SCLK)
NetJP1_1: JP1.1 U7.3(OUT)
NetJP1_2: JP1.2 U9.46(NMI)
NetJP1_3: JP1.3 R8.1
NetPB8_2: PB8.2 U7.2(IN)
NetPB?_1: PB?.1 R1.2 U6.2(VCC)
NetPB?_2: PB?.2 R2.1
NetR15_2: R15.2 U3.2(IN3)
NetR16_2: R16.2 U3.36(IN2/MODE)
NetR17_2: R17.2 U3.24(IN1/SDO)
NetR19_2: R19.2 U3.14(IN0/SDI)
NetR46_1: R46.1 X1.1(OE)
NetR60_2: R60.2 U?#3.7(I6)
NetR61_2: R61.2 U?#3.8(I7)
NetR62_2: R62.2 U?#3.9(I8)
NetR63_1: R63.1 U?#3.12(I/O8)
NetR?#3_2: R?#3.2 U?#3.5(I4)
NetR?#4_2: R?#4.2 U?#3.6(I5)
NetR?#5_1: R?#5.1 U?#3.15(I/O5)
NetR?#6_1: R?#6.1 U?#3.14(I/O6)
NetR?#7_1: R?#7.1 U?#3.13(I/O7)
NetR?#8_2: R?#8.2 U?#5.8(I7)
NetR?#9_1: R?#9.1 U?#5.13(I/O7)
NetR?#10_2: R?#10.2 U?#5.9(I8)
NetR?#11_1: R?#11.1 U?#5.12(I/O8)
NetU3_21: U3.21(I/O6) U9.28(PCS2)
NetU3_22: U3.22(I/O7) U9.29(PCS3)
NetU3_25: U3.25(I/O8) U9.30(PCS4)
NetU3_26: U3.26(I/O9) U9.32(PCS6/A2)
NetU3_27: U3.27(I/O10) U9.38(MCS0)
NetU3_28: U3.28(I/O11) U9.37(MCS1)
NetU9_31: U9.31(PCS5/A1) U?#3.2(I1)
NetU9_35: U9.35(MCS3) U?#5.4(I3)
NetU9_36: U9.36(MCS2) U?#5.5(I4)
NetU9_47: U9.47(TEST) U9.57(RESET)
NetU9_59: U9.59(X1) X1.3(CLK)

Not connected (* = marked no-connect by the designer): RP?#2 10 11 12 13; RP?#3 2 3 4 5; U3 15(I/O0) 16(I/O1) 29(I/O12) 30(I/O13) 31(I/O14) 32(I/O15) 37(I/O16) 38(I/O17) 39(I/O18) 40(I/O19); U7X 12(8Q) 13(7Q) 14(6Q) 15(5Q); U9 22(TMOUT0) 23(TMOUT1) 48(LOCK) 51(HLDA) 52(S0) 53(S1) 54(S2) 58(X2) 64(RFSH)

### Buses and harness runs
bus A[0..19] = port Address_Bus
bus CPLD_Signals = port CPLD_Signals
bus CPU_Signals = port CPU_Signals
bus D[0..7] = port Data_Bus

### Notes on the sheet
- MCS3: DRAM Refresh
- UCS: ROM
- LCS: SRAM
- PCS6: Display Brightness
- PCS5: Display
- MCS0: IDE
- MCS2: DRAM
- MCS1: DRAM
- PCS1: Buttons
- (near U9) PCS0: Rotary Encoders
- PCS2: MP3 SDI
- PCS4: MP3
- PCS3: MP3 SCI
- INT0: Buttons
- INT1: MP3 Data Request
- INT2: MP3 Demand
- INT3: Rotary Encoders
- MP3_DREQ and MP3_Demand from U24
- in Jukebox Peripherals schematic

### Library data of the parts
PB8 PB? = SW-PB: Switch; Published: 24-Mar-1999; LatestRevisionDate: 17-Jul-2002; LatestRevisionNote: Re-released for DXP Platform.; PackageReference: SPST-2; Publisher: Altium Limited; PackageDescription: Switch; 2 Leads
R1 R2 R8 R15-R17 R19 R46 R60-R63 R?#3-R?#11 = Res1: Resistor; Published: 8-Jun-2000; LatestRevisionDate: 17-Jul-2002; LatestRevisionNote: Re-released for DXP Platform.; PackageReference: AXIAL-0.3; Publisher: Altium Limited; PackageDescription: Axial Device, Thru-Hole; 2 Leads; 0.3 in Pin Spacing
RP?#2 RP?#3 = RPACK12
U3 = ISPLSI1016: In-System Programmable High Density CPLD
U4X U6X = 74HCT245: Octal Bus Transceiver
U5X U7X = 74HCT573: Octal Transparent Latch
U6 = MAX709: Maxim Power-On Reset
U7 = MAX6816: Single Switch Debouncer
U9 = 80C188XL: Intel 80188 Microprocessor
U?#4 = 74HCT244: Octal Buffer
X1 = OSCOE: as X2 on sheet Jukebox Peripherals

## Nets that join several sheets
AGND: Jukebox Peripherals (10 pins), Jukebox Power (9 pins)
GND: Jukebox Memory (39 pins), Jukebox Peripherals (32 pins), Jukebox Power (41 pins), Jukebox Processing (41 pins)
V3.3: Jukebox Peripherals (9 pins), Jukebox Power (11 pins)
VCC: Jukebox Memory (19 pins), Jukebox Peripherals (12 pins), Jukebox Power (38 pins), Jukebox Processing (21 pins)
A0: Jukebox Memory (U12.3 U14.12 U18.12), Jukebox Processing (U3.17 U5X.19)
A1: Jukebox Memory (U12.13 U14.11 U18.11), Jukebox Processing (U5X.18)
A2: Jukebox Memory (U12.6 U14.10 U18.10), Jukebox Processing (U5X.17)
A3: Jukebox Memory (U12.10 U14.9 U18.9), Jukebox Processing (U5X.16)
A4: Jukebox Memory (U14.8 U16.3 U18.8), Jukebox Processing (U5X.15)
A5: Jukebox Memory (U14.7 U16.13 U18.7), Jukebox Processing (U5X.14)
A6: Jukebox Memory (U14.6 U16.6 U18.6), Jukebox Processing (U5X.13)
A7: Jukebox Memory (U14.5 U16.10 U18.5), Jukebox Processing (U5X.12)
A8: Jukebox Memory (U14.27 U17.3 U18.27), Jukebox Processing (U6X.18)
A9: Jukebox Memory (J1.35 U14.26 U18.26), Jukebox Processing (U6X.17)
A10: Jukebox Memory (J1.33 U12.2 U14.23 U18.23), Jukebox Processing (U6X.16)
A11: Jukebox Memory (J1.36 U12.14 U14.25 U18.25), Jukebox Processing (U6X.15)
A12: Jukebox Memory (U12.5 U14.4 U18.4), Jukebox Processing (U6X.14)
A13: Jukebox Memory (U12.11 U14.28 U18.28), Jukebox Processing (U6X.13)
A14: Jukebox Memory (U14.29 U16.2 U18.3), Jukebox Processing (U6X.12)
A15: Jukebox Memory (U14.3 U16.14 U18.31), Jukebox Processing (U6X.11)
A16: Jukebox Memory (U14.2 U16.5 U18.2), Jukebox Processing (U7X.19)
A17: Jukebox Memory (U14.30 U16.11 U18.1), Jukebox Processing (U7X.18)
A18: Jukebox Memory (U17.2), Jukebox Processing (U7X.17)
BTN_INT: Jukebox Peripherals (U19.11), Jukebox Processing (U?#5.3)
D0: Jukebox Memory (5 pins), Jukebox Peripherals (5 pins), Jukebox Processing (U4X.18)
D1: Jukebox Memory (5 pins), Jukebox Peripherals (U19.15 U21.13 U?#1.3), Jukebox Processing (U4X.17)
D2: Jukebox Memory (5 pins), Jukebox Peripherals (U19.16 U?#1.4), Jukebox Processing (U4X.16)
D3: Jukebox Memory (5 pins), Jukebox Peripherals (U19.17 U?#1.5), Jukebox Processing (U4X.15)
D4: Jukebox Memory (5 pins), Jukebox Peripherals (U19.18 U?#1.6), Jukebox Processing (U4X.14)
D5: Jukebox Memory (5 pins), Jukebox Peripherals (U19.19 U?#1.7), Jukebox Processing (U4X.13)
D6: Jukebox Memory (5 pins), Jukebox Peripherals (U19.13 U?#1.8), Jukebox Processing (U4X.12)
D7: Jukebox Memory (5 pins), Jukebox Peripherals (U19.12 U?#1.9), Jukebox Processing (U4X.11)
DISP_CS: Jukebox Peripherals (LCD1.4), Jukebox Processing (U?#3.16)
DISP_E: Jukebox Peripherals (LCD1.6), Jukebox Processing (U?#3.19)
DISP_RW: Jukebox Peripherals (LCD1.5), Jukebox Processing (U?#3.18)
DRAM_CAS: Jukebox Memory (R58.2), Jukebox Processing (U?#5.16)
DRAM_RAS: Jukebox Memory (R57.2), Jukebox Processing (U?#5.17)
DRAM_WE: Jukebox Memory (R59.2), Jukebox Processing (U?#5.15)
DTR: Jukebox Peripherals (U?#1.1), Jukebox Processing (U3.20 U?#3.4 U?#4.9 U?#5.6)
ENC_INT: Jukebox Peripherals (U21.11), Jukebox Processing (U?#5.2)
IDE_1DIR: Jukebox Memory (U15.1), Jukebox Processing (U3.6)
IDE_1OE: Jukebox Memory (U15.56), Jukebox Processing (U3.7)
IDE_2CLKBA: Jukebox Memory (U15.30), Jukebox Processing (U3.4)
IDE_2OE: Jukebox Memory (U15.29), Jukebox Processing (U3.5)
IDE_CS0: Jukebox Memory (J1.37), Jukebox Processing (U3.10)
IDE_DIOR: Jukebox Memory (J1.23), Jukebox Processing (U3.9)
IDE_DIOW: Jukebox Memory (J1.25), Jukebox Processing (U3.8)
LCS: Jukebox Memory (U18.22), Jukebox Processing (U9.33)
MP3_CLK: Jukebox Peripherals (J4.1 U25.2), Jukebox Processing (U3.43)
MP3_Demand: Jukebox Peripherals (J4.3 R24.2), Jukebox Processing (U?#4.17)
MP3_DREQ: Jukebox Peripherals (U?#2.8), Jukebox Processing (U?#4.15)
MP3_XCS: Jukebox Peripherals (U23.9), Jukebox Processing (U3.3)
MP3_XDCS: Jukebox Peripherals (U23.12), Jukebox Processing (U3.44)
MUX_S: Jukebox Memory (U12.1 U16.1 U17.1), Jukebox Processing (U?#5.14)
PCS0: Jukebox Peripherals (U19.1), Jukebox Processing (U9.25)
PCS1: Jukebox Peripherals (U21.1), Jukebox Processing (U9.27)
POT_CS: Jukebox Peripherals (U22.4), Jukebox Processing (U3.42)
POT_UD: Jukebox Peripherals (U22.3), Jukebox Processing (U3.41)
RD: Jukebox Memory (U14.24 U18.24), Jukebox Processing (U?#4.18)
RESET: Jukebox Memory (J1.1), Jukebox Peripherals (U23.5), Jukebox Processing (5 pins)
UCS: Jukebox Memory (U14.22), Jukebox Processing (U9.34)
WR: Jukebox Memory (U14.31 U18.29), Jukebox Processing (U?#4.16)